# EAGLE schematic diyefispic32mz (EAGLE 7.6.0)

## Sheet 1 of 2
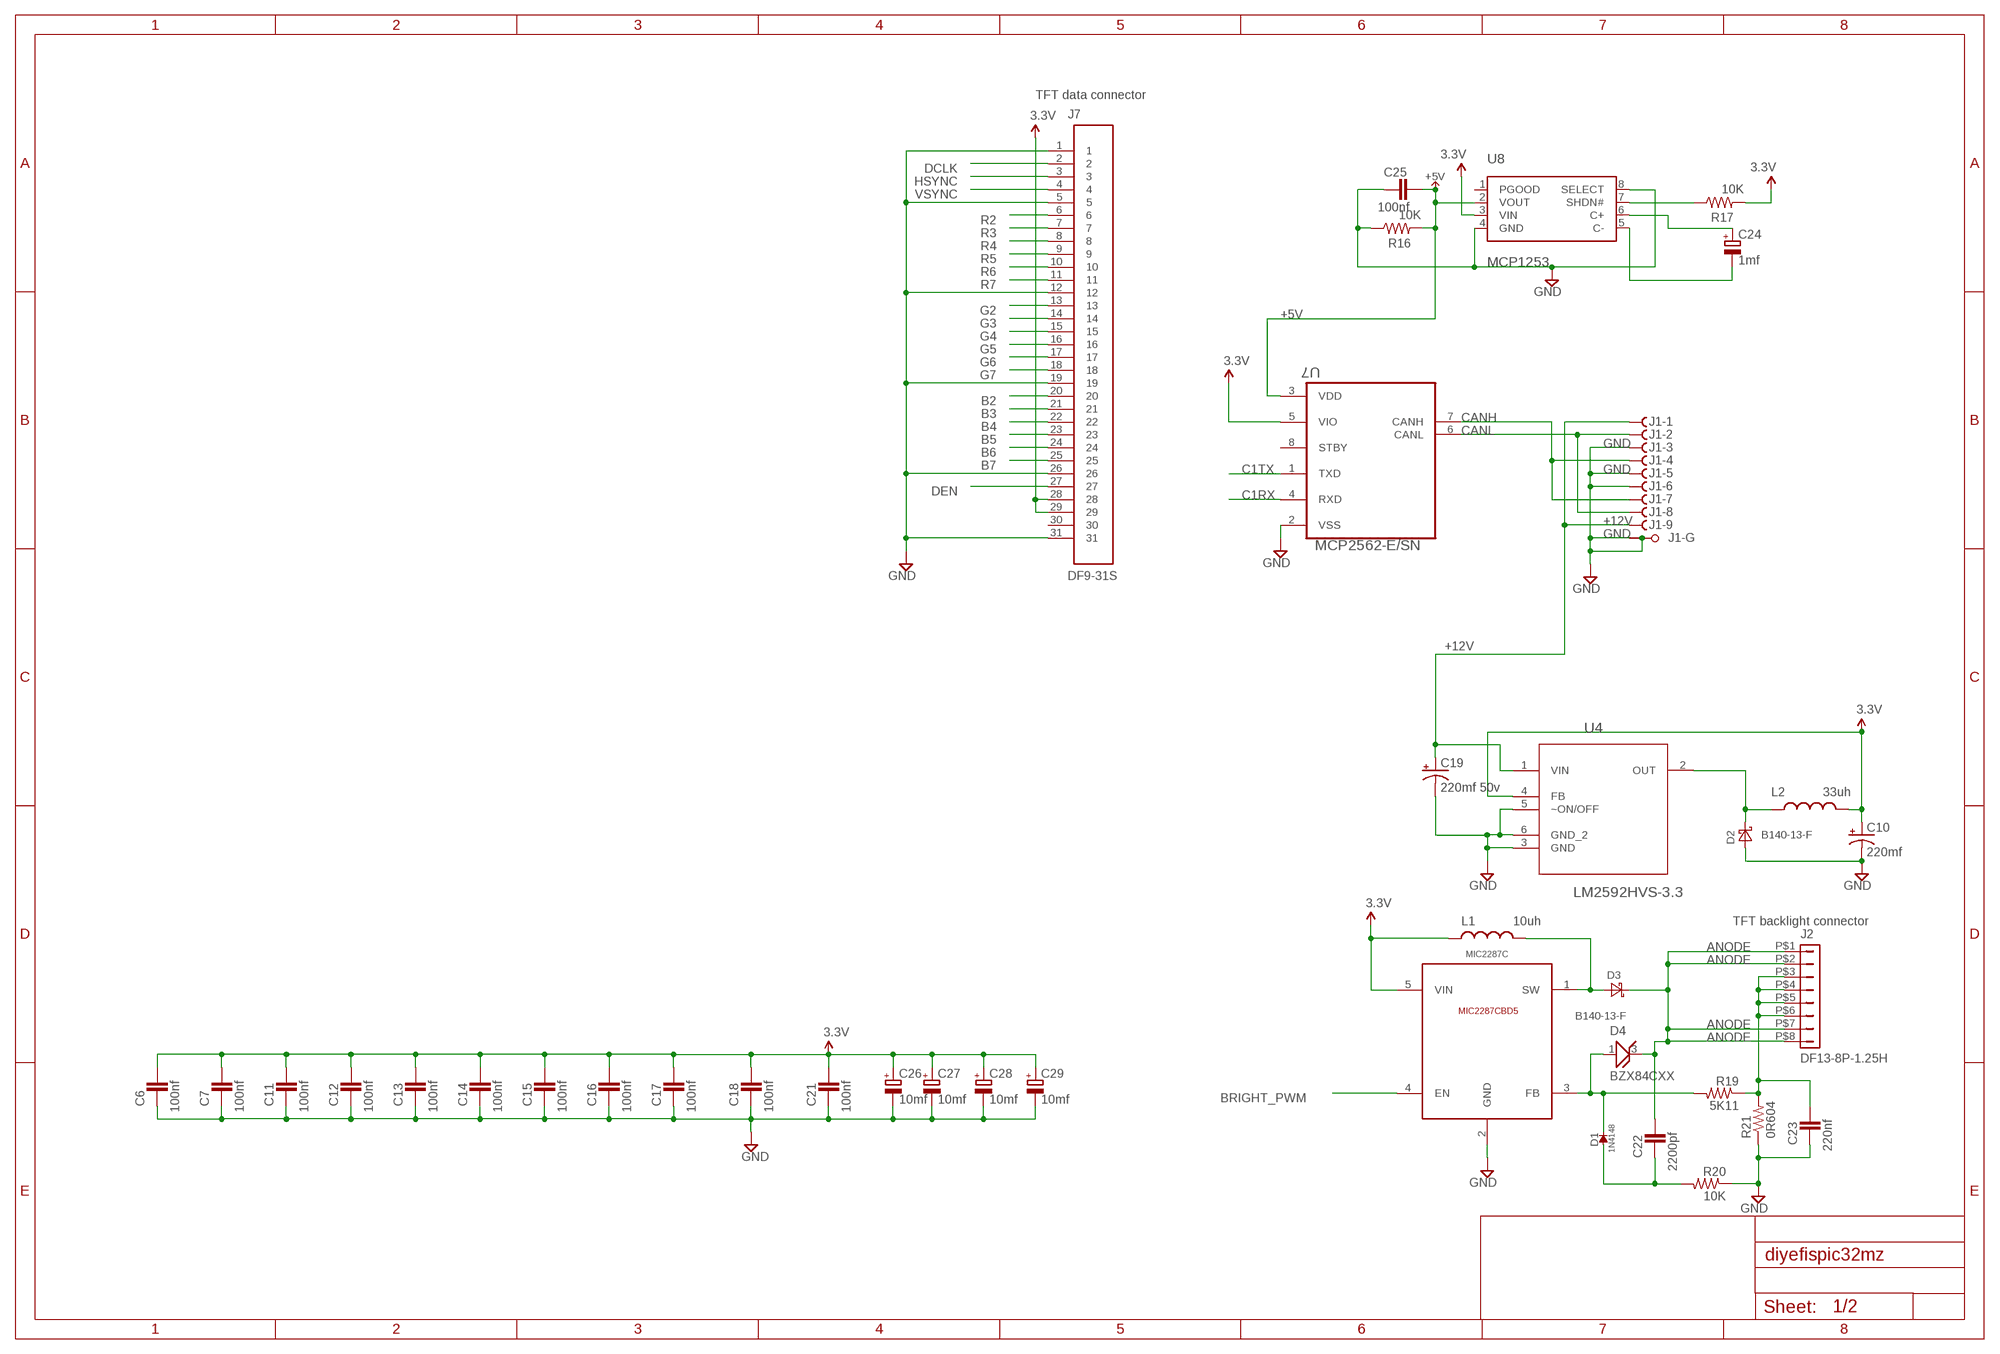
[diagram p0: schematic, sheet 1]

### Parts
C6  100nf  CAPACITOR_NPOL-0805  [C805]
C7  100nf  CAPACITOR_NPOL-0805  [C805]
C10  220mf  CAP_POL7343  [EIA7343]
C11  100nf  CAPACITOR_NPOL-0805  [C805]
C12  100nf  CAPACITOR_NPOL-0805  [C805]
C13  100nf  CAPACITOR_NPOL-0805  [C805]
C14  100nf  CAPACITOR_NPOL-0805  [C805]
C15  100nf  CAPACITOR_NPOL-0805  [C805]
C16  100nf  CAPACITOR_NPOL-0805  [C805]
C17  100nf  CAPACITOR_NPOL-0805  [C805]
C18  100nf  CAPACITOR_NPOL-0805  [C805]
C19  220mf 50v  CAP_POL7343  [EIA7343]
C21  100nf  CAPACITOR_NPOL-0805  [C805]
C22  2200pf  CAPACITOR_NPOL-0805  [C805]
C23  220nf  CAPACITOR_NPOL-0805  [C805]
C24  1mf  CAPACITOR_POL-SMC_A  [SMC_A]
C25  100nf  CAPACITOR_NPOL-0805  [C805]
C26  10mf  CAPACITOR_POL-SMC_A  [SMC_A]
C27  10mf  CAPACITOR_POL-SMC_A  [SMC_A]
C28  10mf  CAPACITOR_POL-SMC_A  [SMC_A]
C29  10mf  CAPACITOR_POL-SMC_A  [SMC_A]
D1  1N4148  1N4148WT  [SOD523]
D2  B140-13-F  DIODE-SCHOTTKY-SMA  [SMA]
D3  B140-13-F  DIODE-SCHOTTKY-SMA  [SMA]
D4  BZX84CXX  [SOT91P240X110-3N]
J1  F09VPS  [F09VP]
J2  DF13-8P-1.25H  [DF13A-8P-1.25H]
J7  DF9-31S  [DF9-31S]
L1  10uh  INDUCTOR  [1812]
L2  33uh  INDUCTOR  [1812]
R16  10K  RESISTOR0603-RES  [0603-RES]
R17  10K  RESISTOR0603-RES  [0603-RES]
R19  5K11  RESISTOR0603-RES  [0603-RES]
R20  10K  RESISTOR0603-RES  [0603-RES]
R21  0R604  RESISTOR1812-RES  [1812]
U4  LM2592HVS-3.3  LM2592HVS-5.0  [TO170P1435X457-5N]
U7  MCP2562-E/SN  [SOIC127P600X175-8N]
U8  MCP1253  [MSOP8]
U9  MIC2287C  [SOT-23-5]

### Nets
3.3V: C6.1 C7.1 C10.A(+) C11.1 C12.1 C13.1 C14.1 C15.1 C16.1 C17.1 C18.1 C21.1 C26.+ C27.+ C28.+ C29.+ J7.28 J7.29 L1.1 L2.2 R17.2 U4.4(FB) U7.5(VIO) U8.3(VIN) U9.5(VIN) ; also sheet 2
+5V: C25.1 R16.2 U7.3(VDD) U8.2(VOUT) ; also sheet 2
+12V: C19.A(+) J1.1(-1:F) J1.9(-9:F) U4.1(VIN)
ANODE: C22.1 D3.C D4.3(CATHODE) J2.P$1 J2.P$2 J2.P$7 J2.P$8
B2: J7.20 ; also sheet 2
B3: J7.21 ; also sheet 2
B4: J7.22 ; also sheet 2
B5: J7.23 ; also sheet 2
B6: J7.24 ; also sheet 2
B7: J7.25 ; also sheet 2
BRIGHT_PWM: U9.4(EN) ; also sheet 2
C1RX: U7.4(RXD) ; also sheet 2
C1TX: U7.1(TXD) ; also sheet 2
CANH: J1.4(-4:F) J1.7(-7:F) U7.7(CANH)
CANL: J1.2(-2:F) J1.8(-8:F) U7.6(CANL)
DCLK: J7.2 ; also sheet 2
DEN: J7.27 ; also sheet 2
G2: J7.13 ; also sheet 2
G3: J7.14 ; also sheet 2
G4: J7.15 ; also sheet 2
G5: J7.16 ; also sheet 2
G6: J7.17 ; also sheet 2
G7: J7.18 ; also sheet 2
GND: C6.2 C7.2 C10.C(-) C11.2 C12.2 C13.2 C14.2 C15.2 C16.2 C17.2 C18.2 C19.C(-) C21.2 C23.2 C25.2 C26.- C27.- C28.- C29.- D2.A J1.3(-3:F) J1.5(-5:F) J1.6(-6:F) J1.G1(-G:G1) J1.G2(-G:G2) J7.1 J7.5 J7.12 J7.19 J7.26 J7.31 R16.1 R20.1 R21.1 U4.3(GND) U4.5(~ON/OFF) U4.6(GND_2) U7.2(VSS) U8.4(GND) U8.8(SELECT) U9.2(GND) ; also sheet 2
HSYNC: J7.3 ; also sheet 2
N$1: C23.1 J2.P$3 J2.P$4 J2.P$5 J2.P$6 R19.1 R21.2
N$12: D2.C L2.1 U4.2(OUT)
N$36: R17.1 U8.7(SHDN#)
N$37: C24.- U8.5(C-)
N$38: C24.+ U8.6(C+)
N$39: D3.A L1.2 U9.1(SW)
N$41: D1.C D4.1(ANODE) R19.2 U9.3(FB)
N$42: C22.2 D1.A R20.2
R2: J7.6 ; also sheet 2
R3: J7.7 ; also sheet 2
R4: J7.8 ; also sheet 2
R5: J7.9 ; also sheet 2
R6: J7.10 ; also sheet 2
R7: J7.11 ; also sheet 2
VSYNC: J7.4 ; also sheet 2
Unconnected: J7.30 U7.8(STBY) U8.1(PGOOD)

### Notes on the sheet
- TFT data connector
- TFT backlight connector

## Sheet 2 of 2
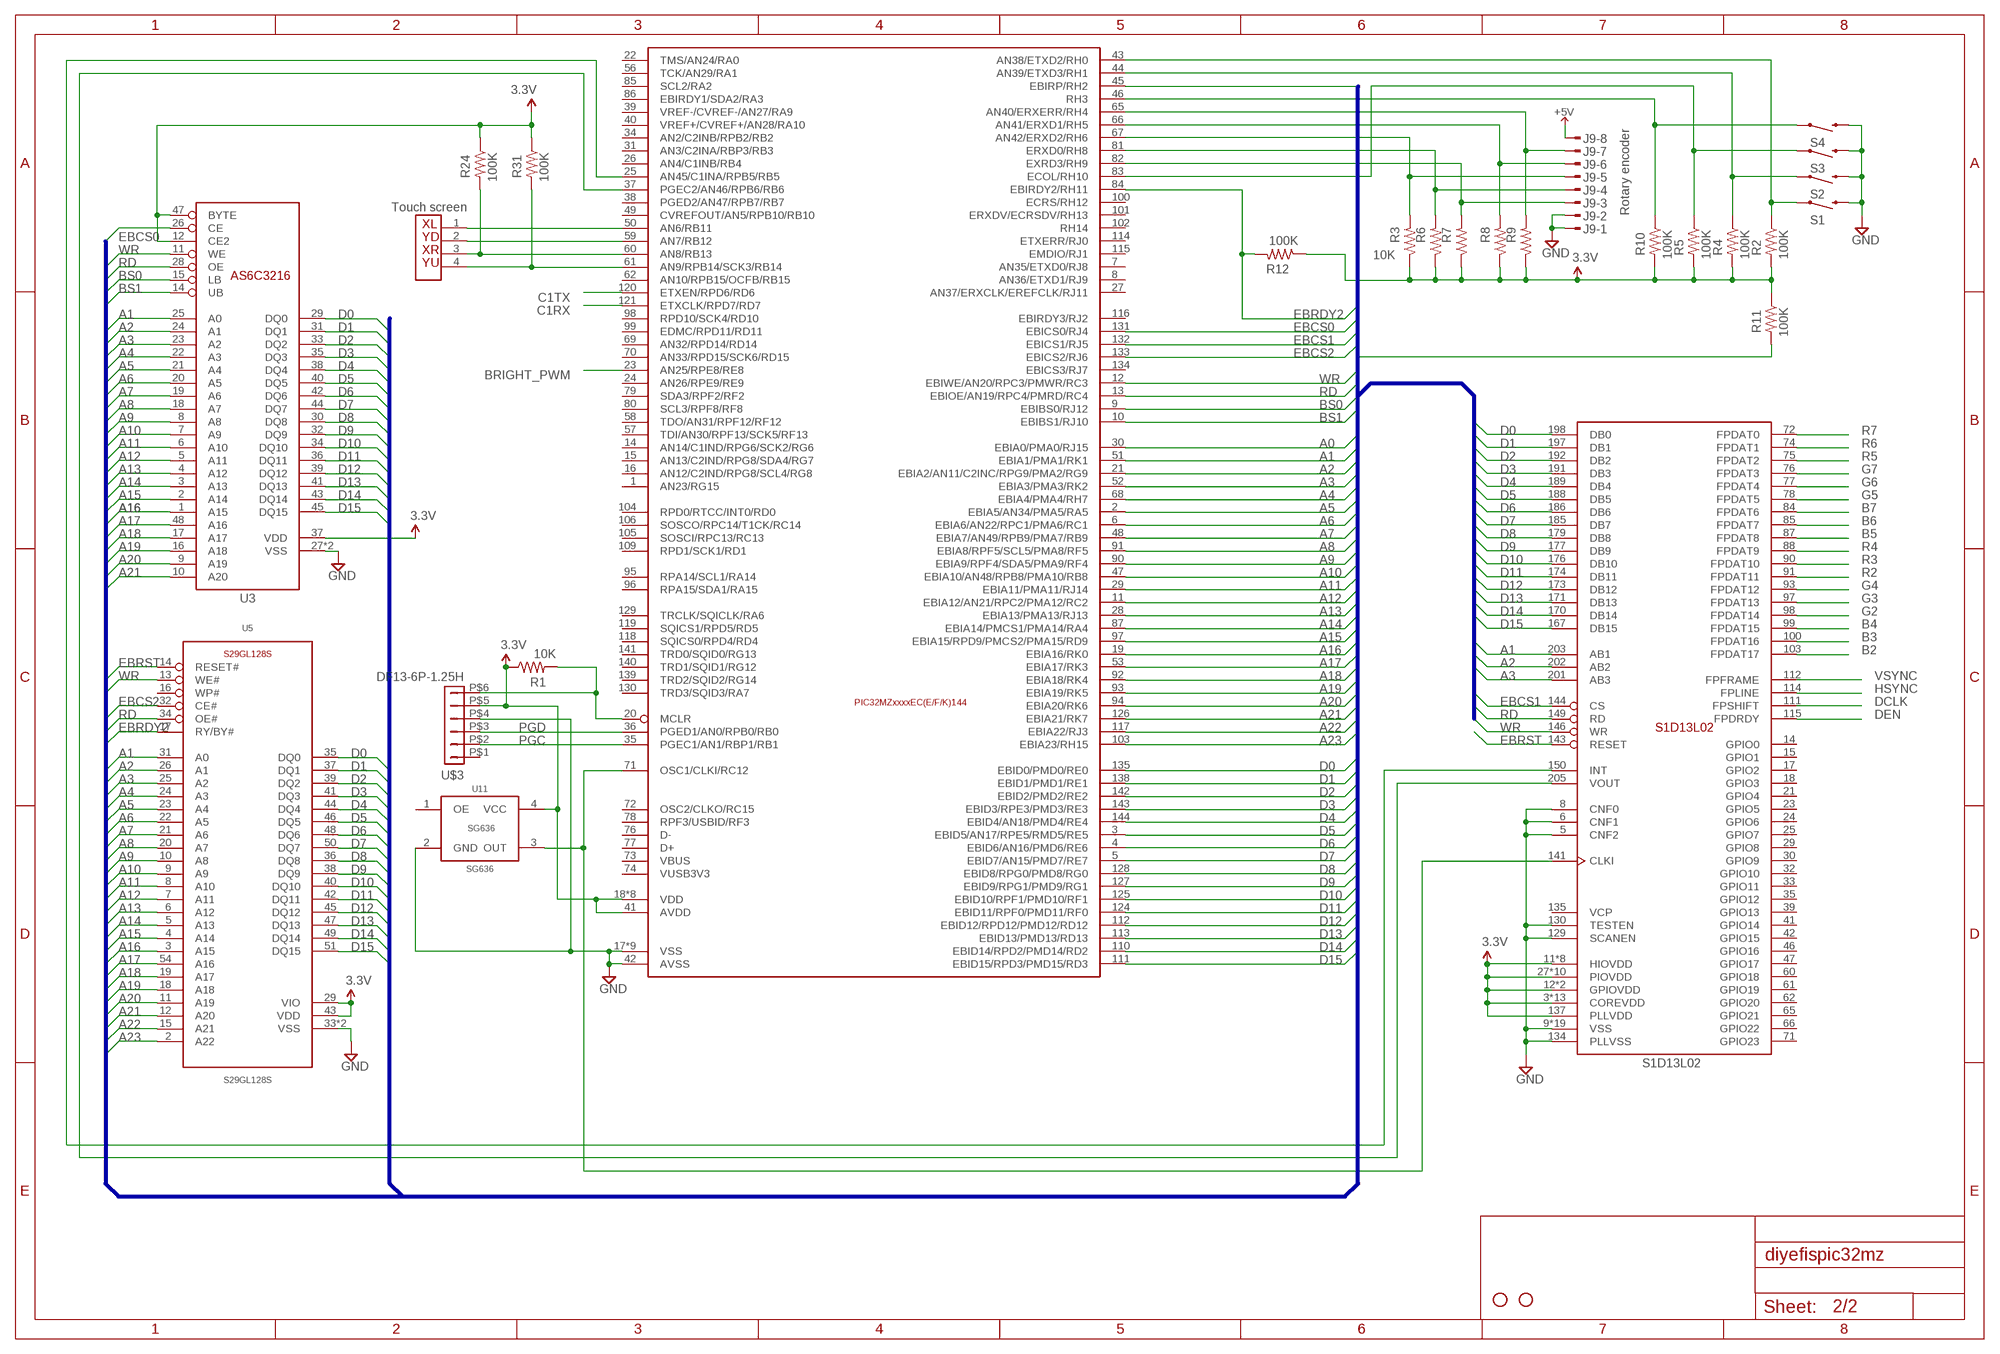
[diagram p1: schematic, sheet 2]

### Parts
J3  XF3M(1)-0415-1B  [XF3M(1)-0415-1B]
J9  MTOP-8  [MTOP-8]
R1  10K  RESISTOR0603-RES  [0603-RES]
R2  100K  RESISTOR0603-RES  [0603-RES]
R3  10K  RESISTOR0603-RES  [0603-RES]
R4  100K  RESISTOR0603-RES  [0603-RES]
R5  100K  RESISTOR0603-RES  [0603-RES]
R6  10K  RESISTOR0603-RES  [0603-RES]
R7  10K  RESISTOR0603-RES  [0603-RES]
R8  10K  RESISTOR0603-RES  [0603-RES]
R9  10K  RESISTOR0603-RES  [0603-RES]
R10  100K  RESISTOR0603-RES  [0603-RES]
R11  100K  RESISTOR0603-RES  [0603-RES]
R12  100K  RESISTOR0603-RES  [0603-RES]
R24  100K  RESISTOR0603-RES  [0603-RES]
R31  100K  RESISTOR0603-RES  [0603-RES]
S1  SWITCH-MOMENTARY-2SMD-4  [TACTILE_SWITCH_TALL]
S2  SWITCH-MOMENTARY-2SMD-4  [TACTILE_SWITCH_TALL]
S3  SWITCH-MOMENTARY-2SMD-4  [TACTILE_SWITCH_TALL]
S4  SWITCH-MOMENTARY-2SMD-4  [TACTILE_SWITCH_TALL]
STANDOFF1  STAND-OFF  [STAND-OFF]
STANDOFF2  STAND-OFF  [STAND-OFF]
U1  PIC32MZXXXXEC(E/F/K)144  [TQFP-144]
U2  S1D13L02  [QFP208]
U3  AS6C3216  [TSOP48]
U5  S29GL128S  [TSOP-56]
U11  SG636  [SG636]
U$3  DF13-6P-1.25H  [DF13A-6P-1.25H]

### Nets
3.3V: R1.1 R2.2 R3.1 R4.2 R5.2 R6.1 R7.1 R8.1 R9.1 R10.2 R11.1 R12.1 R24.1 R31.1 U1.18(VDD) U1.33(VDD) U1.41(AVDD) U1.55(VDD) U1.64(VDD) U1.88(VDD) U1.107(VDD) U1.122(VDD) U1.137(VDD) U2.3(COREVDD) U2.11(HIOVDD) U2.12(GPIOVDD) U2.26(GPIOVDD) U2.27(PIOVDD) U2.36(PIOVDD) U2.38(COREVDD) U2.45(COREVDD) U2.48(PIOVDD) U2.59(PIOVDD) U2.68(PIOVDD) U2.79(PIOVDD) U2.82(COREVDD) U2.94(COREVDD) U2.96(PIOVDD) U2.106(PIOVDD) U2.119(COREVDD) U2.121(PIOVDD) U2.127(PIOVDD) U2.128(COREVDD) U2.133(COREVDD) U2.137(PLLVDD) U2.138(HIOVDD) U2.148(HIOVDD) U2.151(HIOVDD) U2.152(COREVDD) U2.157(HIOVDD) U2.163(COREVDD) U2.168(HIOVDD) U2.181(COREVDD) U2.184(HIOVDD) U2.194(COREVDD) U2.204(COREVDD) U2.208(HIOVDD) U3.12(CE2) U3.37(VDD) U3.47(BYTE) U5.29(VIO) U5.43(VDD) U11.4(VCC) U$3.P$5 ; also sheet 1
!MCLR: R1.2 U1.20(MCLR) U$3.P$6
+5V: J9.8 ; also sheet 1
A0: U1.30(EBIA0/PMA0/RJ15)
A1: U1.51(EBIA1/PMA1/RK1) U2.203(AB1) U3.25(A0) U5.31(A0)
A2: U1.21(EBIA2/AN11/C2INC/RPG9/PMA2/RG9) U2.202(AB2) U3.24(A1) U5.26(A1)
A3: U1.52(EBIA3/PMA3/RK2) U2.201(AB3) U3.23(A2) U5.25(A2)
A4: U1.68(EBIA4/PMA4/RH7) U3.22(A3) U5.24(A3)
A5: U1.2(EBIA5/AN34/PMA5/RA5) U3.21(A4) U5.23(A4)
A6: U1.6(EBIA6/AN22/RPC1/PMA6/RC1) U3.20(A5) U5.22(A5)
A7: U1.48(EBIA7/AN49/RPB9/PMA7/RB9) U3.19(A6) U5.21(A6)
A8: U1.91(EBIA8/RPF5/SCL5/PMA8/RF5) U3.18(A7) U5.20(A7)
A9: U1.90(EBIA9/RPF4/SDA5/PMA9/RF4) U3.8(A8) U5.10(A8)
A10: U1.47(EBIA10/AN48/RPB8/PMA10/RB8) U3.7(A9) U5.9(A9)
A11: U1.29(EBIA11/PMA11/RJ14) U3.6(A10) U5.8(A10)
A12: U1.11(EBIA12/AN21/RPC2/PMA12/RC2) U3.5(A11) U5.7(A11)
A13: U1.28(EBIA13/PMA13/RJ13) U3.4(A12) U5.6(A12)
A14: U1.87(EBIA14/PMCS1/PMA14/RA4) U3.3(A13) U5.5(A13)
A15: U1.97(EBIA15/RPD9/PMCS2/PMA15/RD9) U3.2(A14) U5.4(A14)
A16: U1.19(EBIA16/RK0) U3.1(A15) U5.3(A15)
A17: U1.53(EBIA17/RK3) U3.48(A16) U5.54(A16)
A18: U1.92(EBIA18/RK4) U3.17(A17) U5.19(A17)
A19: U1.93(EBIA19/RK5) U3.16(A18) U5.18(A18)
A20: U1.94(EBIA20/RK6) U3.9(A19) U5.11(A19)
A21: U1.126(EBIA21/RK7) U3.10(A20) U5.12(A20)
A22: U1.117(EBIA22/RJ3) U5.15(A21)
A23: U1.103(EBIA23/RH15) U5.2(A22)
B2: U2.103(FPDAT17) ; also sheet 1
B3: U2.100(FPDAT16) ; also sheet 1
B4: U2.99(FPDAT15) ; also sheet 1
B5: U2.87(FPDAT8) ; also sheet 1
B6: U2.85(FPDAT7) ; also sheet 1
B7: U2.84(FPDAT6) ; also sheet 1
BRIGHT_PWM: U1.23(AN25/RPE8/RE8) ; also sheet 1
BS0: U1.9(EBIBS0/RJ12) U3.15(LB)
BS1: U1.10(EBIBS1/RJ10) U3.14(UB)
C1RX: U1.121(ETXCLK/RPD7/RD7) ; also sheet 1
C1TX: U1.120(ETXEN/RPD6/RD6) ; also sheet 1
D0: U1.135(EBID0/PMD0/RE0) U2.198(DB0) U3.29(DQ0) U5.35(DQ0)
D1: U1.138(EBID1/PMD1/RE1) U2.197(DB1) U3.31(DQ1) U5.37(DQ1)
D2: U1.142(EBID2/PMD2/RE2) U2.192(DB2) U3.33(DQ2) U5.39(DQ2)
D3: U1.143(EBID3/RPE3/PMD3/RE3) U2.191(DB3) U3.35(DQ3) U5.41(DQ3)
D4: U1.144(EBID4/AN18/PMD4/RE4) U2.189(DB4) U3.38(DQ4) U5.44(DQ4)
D5: U1.3(EBID5/AN17/RPE5/RMD5/RE5) U2.188(DB5) U3.40(DQ5) U5.46(DQ5)
D6: U1.4(EBID6/AN16/PMD6/RE6) U2.186(DB6) U3.42(DQ6) U5.48(DQ6)
D7: U1.5(EBID7/AN15/PMD7/RE7) U2.185(DB7) U3.44(DQ7) U5.50(DQ7)
D8: U1.128(EBID8/RPG0/PMD8/RG0) U2.179(DB8) U3.30(DQ8) U5.36(DQ8)
D9: U1.127(EBID9/RPG1/PMD9/RG1) U2.177(DB9) U3.32(DQ9) U5.38(DQ9)
D10: U1.125(EBID10/RPF1/PMD10/RF1) U2.176(DB10) U3.34(DQ10) U5.40(DQ10)
D11: U1.124(EBID11/RPF0/PMD11/RF0) U2.174(DB11) U3.36(DQ11) U5.42(DQ11)
D12: U1.112(EBID12/RPD12/PMD12/RD12) U2.173(DB12) U3.39(DQ12) U5.45(DQ12)
D13: U1.113(EBID13/PMD13/RD13) U2.171(DB13) U3.41(DQ13) U5.47(DQ13)
D14: U1.110(EBID14/RPD2/PMD14/RD2) U2.170(DB14) U3.43(DQ14) U5.49(DQ14)
D15: U1.111(EBID15/RPD3/PMD15/RD3) U2.167(DB15) U3.45(DQ15) U5.51(DQ15)
DCLK: U2.111(FPSHIFT) ; also sheet 1
DEN: U2.115(FPDRDY) ; also sheet 1
EBCS0: U1.131(EBICS0/RJ4) U3.26(CE)
EBCS1: U1.132(EBICS1/RJ5) U2.144(CS)
EBCS2: U1.133(EBICS2/RJ6) U5.32(CE#)
EBRDY2: R12.2 U1.84(EBIRDY2/RH11) U5.17(RY/BY#)
EBRST: R11.2 U1.45(EBIRP/RH2) U2.143(RESET) U5.14(RESET#)
G2: U2.98(FPDAT14) ; also sheet 1
G3: U2.97(FPDAT13) ; also sheet 1
G4: U2.93(FPDAT12) ; also sheet 1
G5: U2.78(FPDAT5) ; also sheet 1
G6: U2.77(FPDAT4) ; also sheet 1
G7: U2.76(FPDAT3) ; also sheet 1
GND: J9.1 J9.2 S1.B2 S2.B2 S3.B2 S4.B2 U1.17(VSS) U1.32(VSS) U1.42(AVSS) U1.54(VSS) U1.63(VSS) U1.75(VSS) U1.89(VSS) U1.108(VSS) U1.123(VSS) U1.136(VSS) U2.5(CNF2) U2.6(CNF1) U2.8(CNF0) U2.9(VSS) U2.20(VSS) U2.28(VSS) U2.44(VSS) U2.50(VSS) U2.58(VSS) U2.69(VSS) U2.80(VSS) U2.95(VSS) U2.109(VSS) U2.120(VSS) U2.129(SCANEN) U2.130(TESTEN) U2.132(VSS) U2.134(PLLVSS) U2.140(VSS) U2.147(VSS) U2.155(VSS) U2.166(VSS) U2.187(VSS) U2.200(VSS) U2.206(VSS) U3.27(VSS) U3.46(VSS) U5.33(VSS) U5.52(VSS) U11.2(GND) U$3.P$4 ; also sheet 1
GPG0: J9.7 R9.2 U1.65(AN40/ERXERR/RH4)
GPG1: J9.6 R8.2 U1.66(AN41/ERXD1/RH5)
GPG2: J9.3 R7.2 U1.82(EXRD3/RH9)
GPG3: J9.4 R6.2 U1.81(ERXD0/RH8)
GPG4: J9.5 R3.2 U1.67(AN42/ERXD2/RH6)
HSYNC: U2.114(FPLINE) ; also sheet 1
N$2: U1.71(OSC1/CLKI/RC12) U2.141(CLKI) U11.3(OUT)
N$3: J3.1 U1.50(AN6/RB11)
N$10: J3.2 U1.59(AN7/RB12)
N$11: J3.3 R24.2 U1.60(AN8/RB13)
N$13: J3.4 R31.2 U1.61(AN9/RPB14/SCK3/RB14)
N$23: R2.1 S1.A2 U1.43(AN38/ETXD2/RH0)
N$27: R4.1 S2.A2 U1.44(AN39/ETXD3/RH1)
N$28: R5.1 S3.A2 U1.83(ECOL/RH10)
N$29: R10.1 S4.A2 U1.46(RH3)
PGC: U1.35(PGEC1/AN1/RBP1/RB1) U$3.P$2
PGD: U1.36(PGED1/AN0/RPB0/RB0) U$3.P$3
R2: U2.91(FPDAT11) ; also sheet 1
R3: U2.90(FPDAT10) ; also sheet 1
R4: U2.88(FPDAT9) ; also sheet 1
R5: U2.75(FPDAT2) ; also sheet 1
R6: U2.74(FPDAT1) ; also sheet 1
R7: U2.72(FPDAT0) ; also sheet 1
RD: U1.13(EBIOE/AN19/RPC4/PMRD/RC4) U2.149(RD) U3.28(OE) U5.34(OE#)
VID_INT: U1.25(AN45/C1INA/RPB5/RB5) U2.150(INT)
VID_VSYNC: U1.37(PGEC2/AN46/RPB6/RB6) U2.205(VOUT)
VSYNC: U2.112(FPFRAME) ; also sheet 1
WR: U1.12(EBIWE/AN20/RPC3/PMWR/RC3) U2.146(WR) U3.11(WE) U5.13(WE#)
Unconnected: U1.1(AN23/RG15) U1.7(AN35/ETXD0/RJ8) U1.8(AN36/ETXD1/RJ9) U1.14(AN14/C1IND/RPG6/SCK2/RG6) U1.15(AN13/C2IND/RPG8/SDA4/RG7) U1.16(AN12/C2IND/RPG8/SCL4/RG8) U1.22(TMS/AN24/RA0) U1.24(AN26/RPE9/RE9) U1.26(AN4/C1INB/RB4) U1.27(AN37/ERXCLK/EREFCLK/RJ11) U1.31(AN3/C2INA/RBP3/RB3) U1.34(AN2/C2INB/RPB2/RB2) U1.38(PGED2/AN47/RPB7/RB7) U1.39(VREF-/CVREF-/AN27/RA9) U1.40(VREF+/CVREF+/AN28/RA10) U1.49(CVREFOUT/AN5/RPB10/RB10) U1.56(TCK/AN29/RA1) U1.57(TDI/AN30/RPF13/SCK5/RF13) U1.58(TDO/AN31/RPF12/RF12) U1.62(AN10/RPB15/OCFB/RB15) U1.69(AN32/RPD14/RD14) U1.70(AN33/RPD15/SCK6/RD15) U1.72(OSC2/CLKO/RC15) U1.73(VBUS) U1.74(VUSB3V3) U1.76(D-) U1.77(D+) U1.78(RPF3/USBID/RF3) U1.79(SDA3/RPF2/RF2) U1.80(SCL3/RPF8/RF8) U1.85(SCL2/RA2) U1.86(EBIRDY1/SDA2/RA3) U1.95(RPA14/SCL1/RA14) U1.96(RPA15/SDA1/RA15) U1.98(RPD10/SCK4/RD10) U1.99(EDMC/RPD11/RD11) U1.100(ECRS/RH12) U1.101(ERXDV/ECRSDV/RH13) U1.102(RH14) U1.104(RPD0/RTCC/INT0/RD0) U1.105(SOSCI/RPC13/RC13) U1.106(SOSCO/RPC14/T1CK/RC14) U1.109(RPD1/SCK1/RD1) U1.114(ETXERR/RJ0) U1.115(EMDIO/RJ1) U1.116(EBIRDY3/RJ2) U1.118(SQICS0/RPD4/RD4) U1.119(SQICS1/RPD5/RD5) U1.129(TRCLK/SQICLK/RA6) U1.130(TRD3/SQID3/RA7) U1.134(EBICS3/RJ7) U1.139(TRD2/SQID2/RG14) U1.140(TRD1/SQID1/RG12) U1.141(TRD0/SQID0/RG13) U2.14(GPIO0) U2.15(GPIO1) U2.17(GPIO2) U2.18(GPIO3) U2.21(GPIO4) U2.23(GPIO5) U2.24(GPIO6) U2.25(GPIO7) U2.29(GPIO8) U2.30(GPIO9) U2.32(GPIO10) U2.33(GPIO11) U2.35(GPIO12) U2.39(GPIO13) U2.41(GPIO14) U2.42(GPIO15) U2.46(GPIO16) U2.47(GPIO17) U2.60(GPIO18) U2.61(GPIO19) U2.62(GPIO20) U2.65(GPIO21) U2.66(GPIO22) U2.71(GPIO23) U2.135(VCP) U5.16(WP#) U11.1(OE) U$3.P$1

### Buses
EBUS

### Notes on the sheet
- Touch screen
- Rotary encoder
- XL
- YD
- XR
- YU

## Library data of the parts
C6 C7 C11-C18 C21 C25 = dp_devices:CAPACITOR_NPOL: Non-Polarized capacitor in various packages; PARTNO: CL21F104ZBCNNNC
C10 C19 = SparkFun:CAP_POL: Capacitor Polarized These are standard SMD and PTH capacitors. Normally 10uF, 47uF, and 100uF in electrolytic and tantalum varieties. Always verify the external diameter of the through hole cap, it varies with capacity, voltage, and manufacturer. The EIA devices should be standard.; PARTNO: T545X227M016ATE035
C22 = dp_devices:CAPACITOR_NPOL: Non-Polarized capacitor in various packages; PARTNO: CL21B222KBANNNC
C23 = dp_devices:CAPACITOR_NPOL: Non-Polarized capacitor in various packages; PARTNO: CL21F224ZBCNNNC
C24 = dp_devices:CAPACITOR_POL: Polarized capacitor in various packages; PARTNO: F931C105MAA
C26-C29 = dp_devices:CAPACITOR_POL: Polarized capacitor in various packages; PARTNO: T491A106K004AT
D1 = QuantumOptics:1N4148: 1N4148, fast small signal silicon, 80V 125mAavg trr=4nSmax; PARTNO: 1N4148WT
D2 D3 = diode2:DIODE-SCHOTTKY-: SCHOTTKY DIODE; PARTNO: B140-13-F
D4 = Diodes_Inc_By_element14_Batch_1:BZX84CXX; PARTNO: BZX84C30-7-F
J1 = con-subd:F09VPS: SUB-D; OC_FARNELL: unknown; OC_NEWARK: unknown; PARTNO: 3-1634222-2
J2 = con-hirose-df13:DF13-8P-1.25: DF13-8P 1.25mm Pitch Miniature Crimping Connector.; PARTNO: DF13A-8P-1.25H(50)
J3 = XF3M(1)-0415-1B:XF3M(1)-0415-1B; PARTNO: XF3M(1)-0415-1B
J7 = con-hirose:DF9-31S: SMD CONNECTOR Source: con-hirose.lbr from Bob Starr <rtzaudio@mindspring.com>; MPN: DF9-31S-1V(32); OC_FARNELL: 1798382; OC_NEWARK: 74R3383; PARTNO: DF9-31S-1V(32)
J9 = con-amp:MTOP-8: AMP connector; PARTNO: 7-215079-8
L1 = SparkFun:INDUCTOR: Inductors Basic Inductor/Choke - 0603 and 1206. Footprints are not proven and vary greatly between part numbers.; PARTNO: VLF504015MT-100M
L2 = SparkFun:INDUCTOR: Inductors Basic Inductor/Choke - 0603 and 1206. Footprints are not proven and vary greatly between part numbers.; PARTNO: LQH43MN330K03L
R1 R3 R6-R9 R12 R16 R17 R20 = SparkFun-Passives:RESISTOR: Resistor; PARTNO: RC0603FR-0710KL
R2 R4 R5 R10 R11 R24 R31 = SparkFun-Passives:RESISTOR: Resistor; PARTNO: RC0603JR-07100KL
R19 = SparkFun-Passives:RESISTOR: Resistor; PARTNO: RC0603FR-075K23L
R21 = SparkFun:RESISTOR: Resistor; PARTNO: RL1218FK-070R604L
S1-S4 = SparkFun-Electromechanical:SWITCH-MOMENTARY-2: Various NO switches- pushbuttons, reed, etc; PARTNO: MJTP1138BTR; PROD_ID: SWCH-11966
STANDOFF1 STANDOFF2 = SparkFun-Electromechanical:STAND-OFF: #4 Stand Off This is the mechanical footprint for a #4 phillips button head screw. Use the keepout ring to avoid running the screw head into surrounding components. SKU : PRT-00447; PARTNO: *
U1 = PIC32MZxxxxEC(GHM):PIC32MZXXXXEC(E/F/K)144; PARTNO: PIC32MZ2048ECH144-I/PH
U2 = epson:S1D13L02; PARTNO: S1D13L02F00A100
U3 = alliance:AS6C3216; PARTNO: AS6C3216-55TIN
U4 = NSC_By_element14_Batch_1.1:LM2592HVS-5.0: SIMPLE SWITCHER; MPN: LM2592HVS-5.0; OC_FARNELL: -; OC_NEWARK: 41K3791; PACKAGE: TO-263-5; PARTNO: LM2592HVSX-3.3/NOPB; SUPPLIER: National Semiconductor
U5 = Cypress:S29GL128S; PARTNO: S29GL128S90TFI010
U7 = Microchip-MCP2562-E_SN:MCP2562-E/SN: High-Speed CAN Transceiver,SOIC-8; MPN: MCP2562-E/SN; OC_FARNELL: 2362839; OC_NEWARK: 85W9074; PACKAGE: SOIC-8; PARTNO: MCP2562-E/SN; SUPPLIER: Microchip
U8 = microchip-dspic:MCP1253: Positive-Regulated Charge Pump (3.3x5.0); PARTNO: MCP1253-33X50I/MS
U9 = Microchip_By_element14_Batch_1:MIC2287C; PARTNO: MIC2287CYD5-TR
U11 = epson:SG636; PARTNO: SG-636PCE 10.000MHZ
U$3 = con-hirose-df13:DF13-6P-1.25: DF13-6P 1.25mm Pitch Miniature Crimping Connector.; PARTNO: DF13A-6P-1.25H(20)